# EAGLE design HighPowerLEDBabyBell (EAGLE 9.6.2)
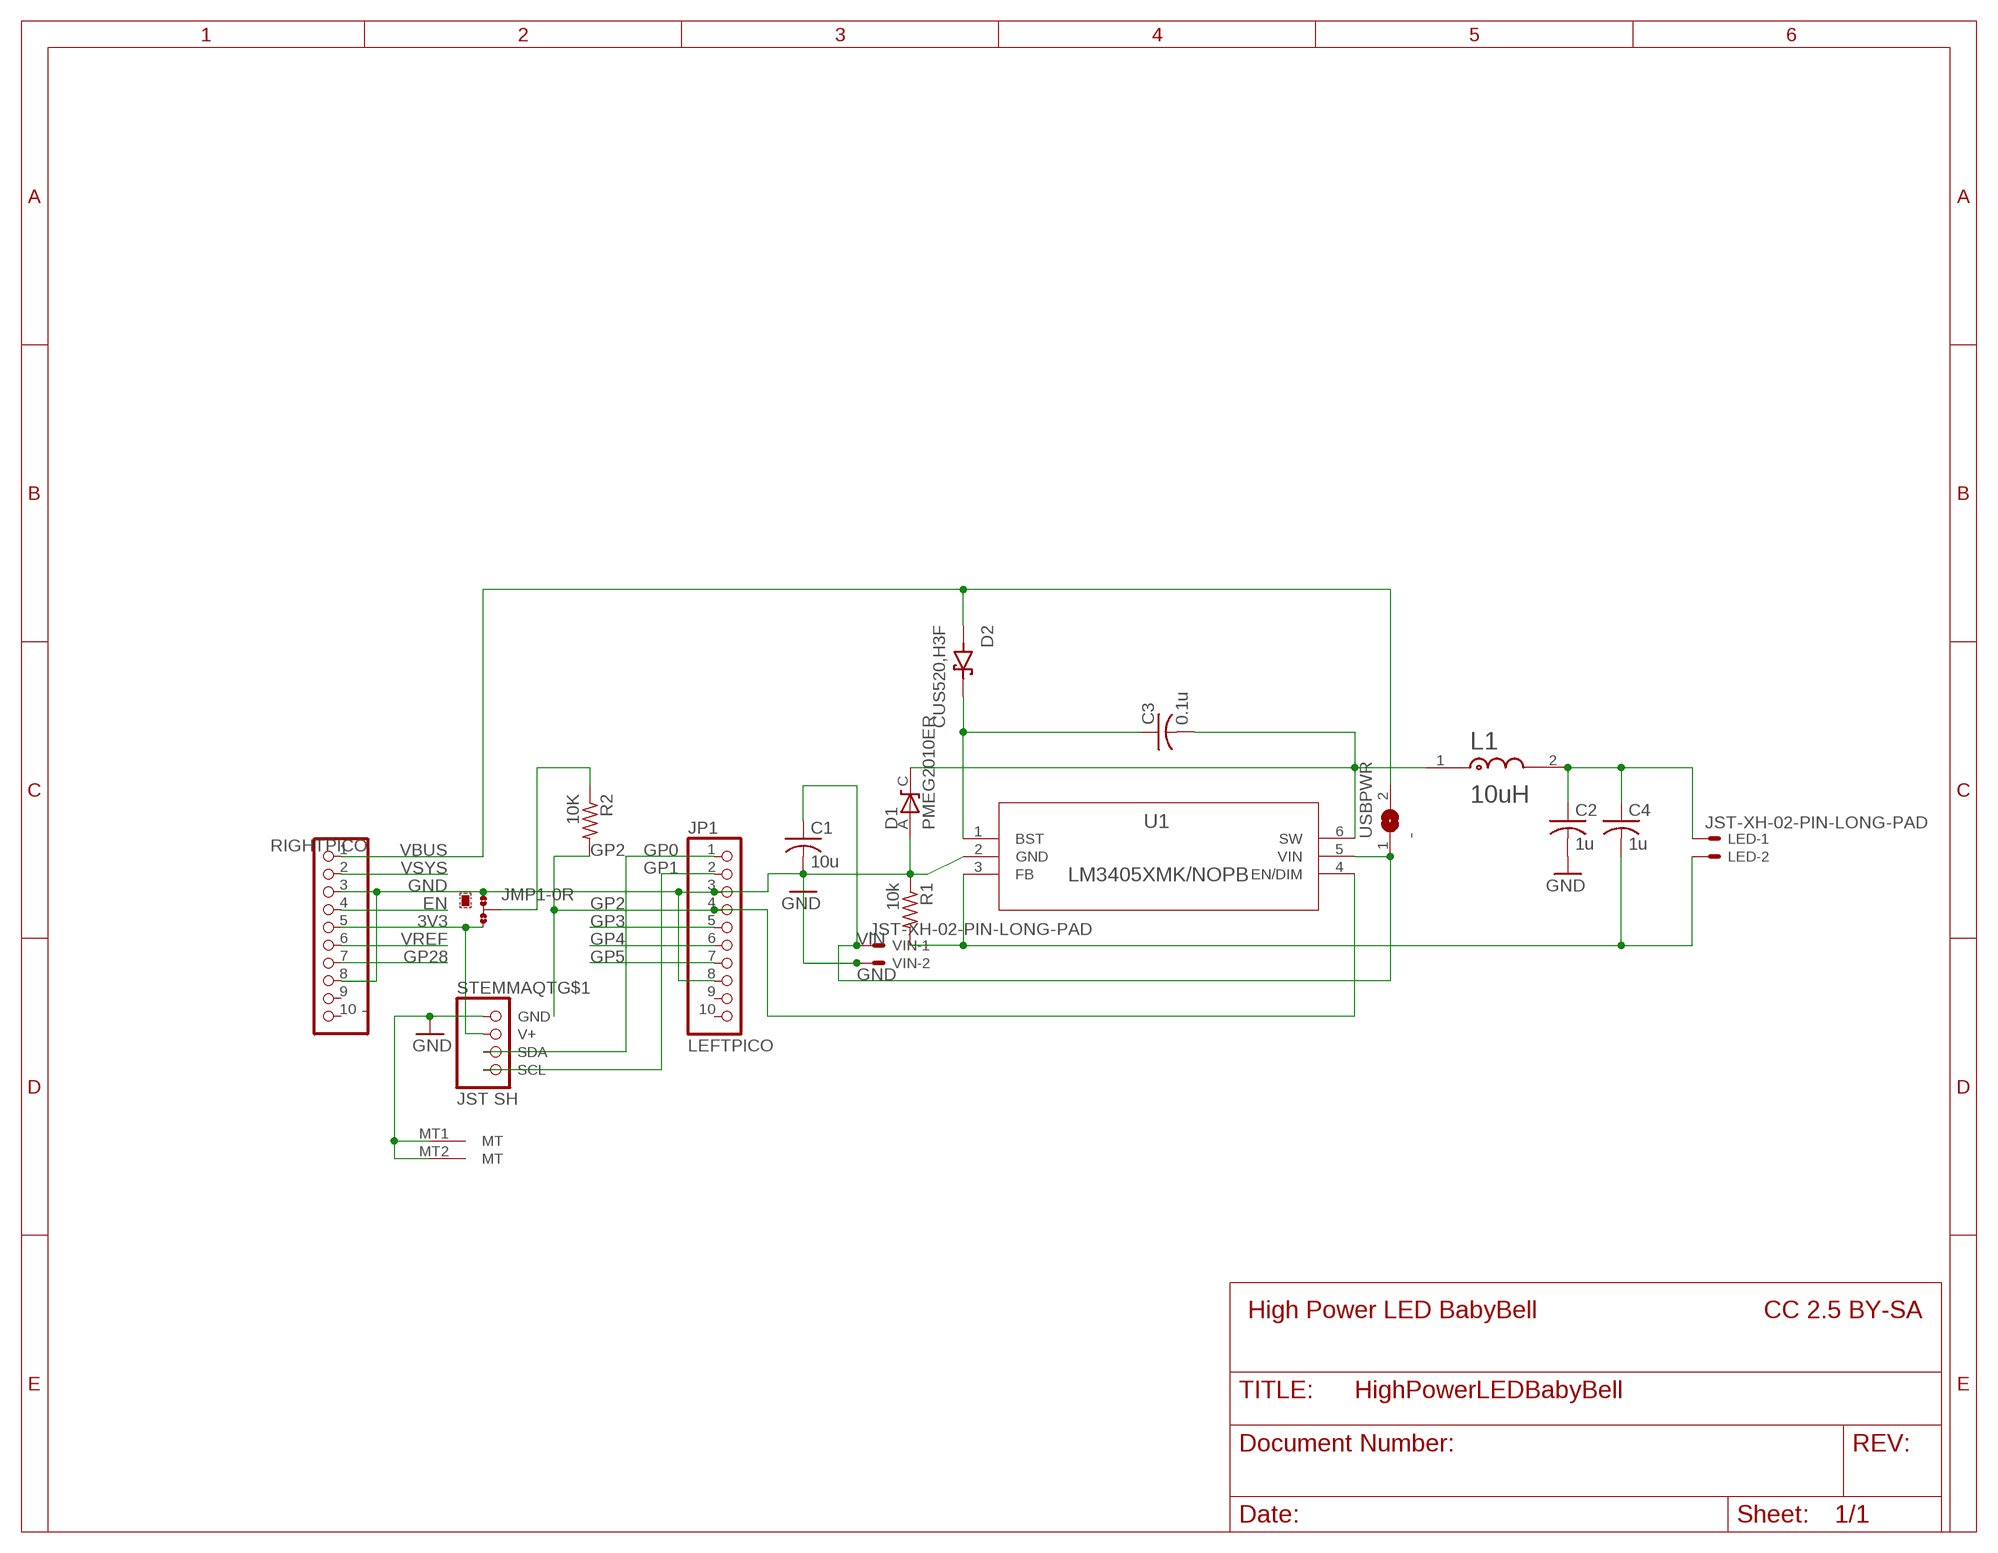
[diagram p0: schematic, sheet 1]

## Parts
C1  10u  C-USC1206  [C1206]
C2  1u  C-USC1206  [C1206]
C3  0.1u  C-USC1206  [C1206]
C4  1u  C-USC1206  [C1206]
D1  PMEG2010ER  [SODFL3517X110N]
D2  CUS520,H3F  [DIO_CUS520,H3F]
JMP1  0R-JUMPA  [A0R-JMP]
JP1  LEFTPICO  PINHD-1X10  [1X10]
L1  TDK_VLS5045EX-100MTDK_VLS5045EX-100M_0_0  [TDK_VLS5045EX-100M_0]
LED  JST-XH-02-PIN-LONG-PAD  [JST-XH-02-PACKAGE-LONG-PAD]
R1  10k  R-US_R1206  [R1206]
R2  10K  R-US_R1206  [R1206]
RIGHTPICO  -  PINHD-1X10  [1X10]
STEMMAQT  JST SH  STEMMA_I2C_QTRA  [JST_SH4_RA]
U1  LM3405XMK/NOPB  [MK06A]
USBPWR  -  SJ  [SJ]
VIN  JST-XH-02-PIN-LONG-PAD  [JST-XH-02-PACKAGE-LONG-PAD]

## Nets
3V3: JMP1.3 RIGHTPICO.5 STEMMAQT.2(V+)
BST: C3.1 D2.C U1.1(BST)
EN: RIGHTPICO.4
FB: C4.2 LED.2 R1.2 U1.3(FB)
GND [power]: C1.2 C2.2 D1.A JMP1.1 JP1.3 JP1.8 R1.1 RIGHTPICO.3 RIGHTPICO.8 STEMMAQT.1(GND) STEMMAQT.MT1(MT) STEMMAQT.MT2(MT) U1.2(GND) VIN.2
GP0: JP1.1 STEMMAQT.3(SDA)
GP1: JP1.2 STEMMAQT.4(SCL)
GP2: JP1.4 R2.2 U1.4(EN/DIM)
GP3: JP1.5
GP4: JP1.6
GP5: JP1.7
GP28: RIGHTPICO.7
LED+: C2.1 C4.1 L1.2 LED.1
PUL [power]: JMP1.2 R2.1
SW: C3.2 D1.C L1.1 U1.6(SW)
VBUS: D2.A RIGHTPICO.1 USBPWR.2
VIN [power]: C1.1 U1.5(VIN) USBPWR.1 VIN.1
VREF: RIGHTPICO.6
VSYS: RIGHTPICO.2
Unconnected: JP1.9 JP1.10 RIGHTPICO.9 RIGHTPICO.10

## Notes on the sheet
- High Power LED BabyBell | CC 2.5 BY-SA

## Library data of the parts
C1-C4 = rcl:C-US: CAPACITOR, American symbol; SPICEPREFIX: C
D1 = PMEG2010ER:PMEG2010ER: Diode Schottky 20V 1A 2-Pin SOD-123W T/R; DESCRIPTION: Diode Schottky 20 V 1A Surface Mount SOD-123W; MF: Nexperia USA; MP: PMEG2010ER; PACKAGE: SOD-123W Nexperia USA Inc.; PURCHASE-URL: https://pricing.snapeda.com/search/part/PMEG2010ER/?ref=eda
D2 = CUS520_H3F:CUS520,H3F: Diode Schottky 30V 200mA Surface Mount USC; DESCRIPTION: Diode Schottky 30 V 200mA Surface Mount USC; DIGI-KEY_PART_NUMBER: CUS520H3FTR-ND; MF: Toshiba Semiconductor; MP: CUS520,H3F; PACKAGE: SOD-323 Toshiba; PURCHASE-URL: https://pricing.snapeda.com/search/part/CUS520,H3F/?ref=eda
JMP1 = jump-0r-smd:0R-JUMP: SMD 0R 0805 Jumper
JP1 RIGHTPICO = pinhead_dan:PINHD-1X10: PIN HEADER
L1 = TDK - VLS5045EX-100M:TDK_VLS5045EX-100M: 10µH Shielded Wirewound Inductor 2.5A 79.3mOhm Max Nonstandard; AUTOMOTIVE: No; CENTROID_NOT_SPECIFIED: No; COMPOSITION: Wirewound; CORE_MATERIAL: Ferrite; DATASHEET: https://product.tdk.com/system/files/dam/doc/product/inductor/inductor/smd/catalog/inductor_commercial_power_vls5045ex_en.pdf; DEVICE_CLASS_L1: Passive Components; DEVICE_CLASS_L2: Inductors; DEVICE_CLASS_L3: Fixed Inductors; DIGIKEY_DESCRIPTION: FIXED IND 10UH 2.5A 79.3 MOHM; DIGIKEY_PART_NUMBER: 445-174843-1-ND; FOOTPRINT_VARIANT_NAME_0: Recommended_Land_Pattern; HEIGHT: 4.5mm; INDUCTANCE: 10uH; LEAD_FREE: Yes; MF: TDK; MFG_PACKAGE_IDENT: 0; MFG_PACKAGE_IDENT_DATE: 0; MFG_PACKAGE_IDENT_REV: 0; MOUSER_PART_NUMBER: 810-VLS5045EX-100M; MPN: VLS5045EX-100M; PACKAGE: SMD_IND_5MM0_5MM0; PREFIX: L; RMS_CURRENT: 2.5A; ROHS: Yes; SATURATION_CURRENT: 3.1A; SERIES_RESISTANCE: 79.3mΩ; SHIELDING: true; TEMPERATURE_RANGE_HIGH: +105°C; TEMPERATURE_RANGE_LOW: -40°C; TEST_FREQUENCY: 100kHz; TOLERANCE: 20%; VERIFICATION_VERSION: 0.0.0.3
LED VIN = Rembrandt Electronics - JST XH Connectors v1-0:JST-XH-02-PIN: JST XH Connector 2 Pin Wire to board connector. Pitch: 2,54 mm, (0.100") Number of pins: 2 Created by Rembrandt Electronics www.rembrandtelectronics.com
R1 R2 = rcl:R-US_: RESISTOR, American symbol; SPICEPREFIX: R
STEMMAQT = microbuilder:STEMMA_I2C
U1 = LM3405:LM3405XMK/NOPB; COPYRIGHT: Copyright (C) 2023 Ultra Librarian. All rights reserved.; MANUFACTURER_PART_NUMBER: LM3405XMK/NOPB; MFR_NAME: Texas Instruments
USBPWR = jumper:SJ: SMD solder JUMPER

## Net classes
1 power: width 0.305 mm
2 thickpower: width 0.406 mm

## Board
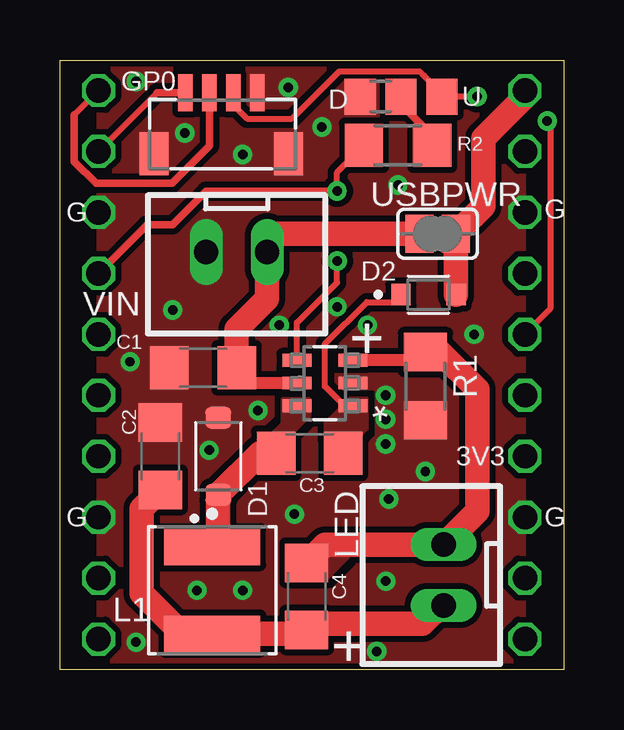
[diagram p1: board, top side]
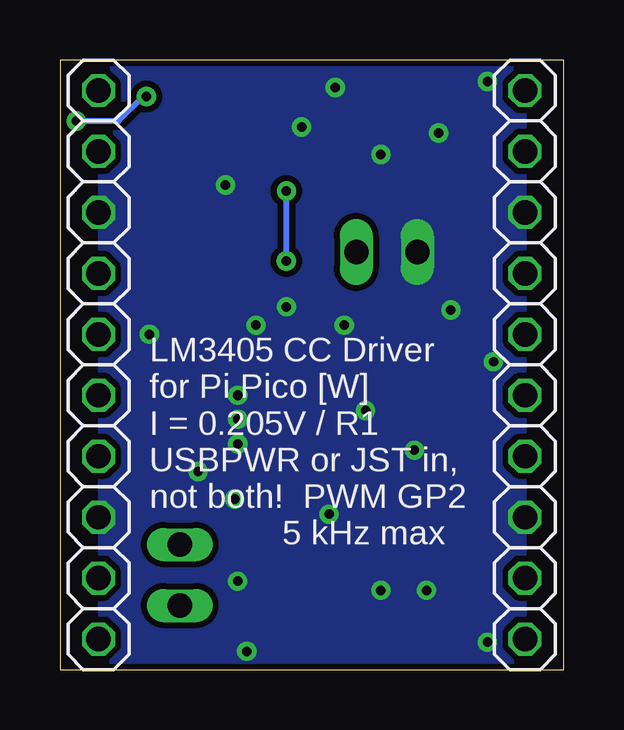
[diagram p2: board, bottom side, seen from below]

Size 21 x 25.4 mm. Coordinates in mm from the lower left corner, seen from the top.
Outline: 21,25.4 21,0 0,0 0,25.4 21,25.4
Copper layers (1*16): Top 0.035mm / dielectric 1.5mm / Bottom 0.035mm
Design rules "adafruit 7-7": minimum track width 7mil, minimum drill 15.5mil, track to track 7mil, track to pad 7mil, pad to pad 7mil, via to via 7mil, smd to smd 7mil, copper to edge 10mil, drill to drill 8mil, minimum pad ring 7mil, minimum via ring 8mil, stop-mask expansion 2mil, vias tented up to drill 20mil, thermal gap 10mil

### Footprints (pad centres in the part's own frame; a part is rotated, then mirrored left to right if it is on the bottom)
C1206 = smd 1.6 x 1.8: 1 -1.4,0; 2 1.4,0
SODFL3517X110N = smd 0.91 x 1.07: A 1.605,0; C -1.605,0
DIO_CUS520,H3F = smd 0.8 x 0.9: A 1.15,0; C -1.15,0
A0R-JMP = smd 1.5 x 1.3: 1 0,1.7; 2 0,0; 3 0,-1.7
1X10 = drill 1.016 octagon: 1 -11.43,0; 2 -8.89,0; 3 -6.35,0; 4 -3.81,0; 5 -1.27,0; 6 1.27,0; 7 3.81,0; 8 6.35,0; 9 8.89,0; 10 11.43,0
TDK_VLS5045EX-100M_0 = smd 1.5 x 4: 1 -1.8,0; 2 1.8,0
JST-XH-02-PACKAGE-LONG-PAD = drill 1.016 long: 1 -1.27,0; 2 1.27,0
R1206 = smd 1.6 x 1.803: 1 -1.422,0; 2 1.422,0
JST_SH4_RA = smd 0.6 x 1.55: 1 1.5,1.686; 2 0.5,1.686; 3 -0.5,1.686; 4 -1.5,1.686 | smd 1.2 x 1.8: MT1 -2.8,-0.862; MT2 2.8,-0.862
MK06A = smd 1.219 x 0.533: 1 -1.168,0.95; 2 -1.168,0; 3 -1.168,-0.95; 4 1.168,-0.95; 5 1.168,0; 6 1.168,0.95
SJ = smd 1.168 x 1.6: 1 -0.762,0; 2 0.762,0

### Placement (x,y rotation side)
C1  5.97,12.57 180 top
C2  4.19,8.89 90 top
C3  10.41,9.02 180 top
C4  10.29,3.05 90 top
D1  6.6,8.89 90 top
D2  15.37,15.62 0 top
JMP1  14.22,23.88 90 top
JP1  1.61,12.7 270 bottom
L1  6.35,3.3 270 top
LED  16,3.94 90 top
R1  15.24,11.81 90 top
R2  14.1,21.84 180 top
RIGHTPICO  19.39,12.7 270 bottom
STEMMAQT  6.73,22.35 0 top
U1  11.05,11.94 180 top
USBPWR  15.75,18.16 0 top
VIN  7.37,17.4 180 top

### Tracks (layer width: path | path; a pad name or v marks a point on that pad's centre or on a via)
3V3  (via drill 0.4)
  Top 0.254: v17.4,23.88 JMP1.3 15.92,24 15.18,24.75 15,24.93 11.65,24.93 9.67,22.96 7.8,22.96 7.25,23.52 7.25,24.02 STEMMAQT.2 | RIGHTPICO.5 20.45,15.03 20.45,22.73 v20.32,22.86
  Bottom 0.254: v20.32,22.86 18.54,22.86 17.53,23.88 v17.4,23.88
BST
  Top 0.254: D2.C 13.91,15.32 12.79,15.32 11.05,13.57 11.05,11.8 11.74,11.11 12.09,11.11 U1.1
  pour Top (isolate 0.254, no thermals): 12.83,11.3 12.06,11.3 11.05,10.29 11.05,9.78 12.57,9.78 12.83,10.03
FB
  Top 0.508: U1.3 15.28,12.89 15.28,13.2 R1.2 15.85,13.23
  Top 1.016: C4.2 11.05,5.21 LED.2 17.4,6.6 17.4,11.68 15.85,13.23
  pour Top (isolate 0.254, no thermals): 11.05,3.68 12.06,4.7 11.05,4.7
GND  (via drill 0.39, 0.4)
  other vias: 13.59,11.43 13.59,10.43 13.59,9.4 2.92,12.83 14.1,20.19 4.7,14.99 6.22,9.14 5.71,3.3 7.62,3.3 9.78,6.48 13.59,3.68 15.24,8.26 13.72,7.11 17.27,13.97 8.26,10.79 12.83,14.35 3.17,24.51 5.21,22.35 9.53,24.26 13.21,0.76 3.17,1.14 9.14,14.35 7.62,21.46 10.92,22.61 11.56,15.11
  pour Top (isolate 0.254, rank 2, no thermals): 1.65,0 1.65,25.4 19.3,25.4 19.3,0
  pour Bottom (isolate 0.254, no thermals): 1.65,0 1.65,25.4 19.3,25.4 19.3,0
GP0
  Top 0.254: 0.59,23.11 JP1.1
  Top 0.305: STEMMAQT.3 6.23,21.82 4.67,20.26 1.5,20.26 0.59,21.17 0.59,23.11
GP1
  Top 0.254: JP1.2 4.06,24.04
  Top 0.305: 4.06,24.04 STEMMAQT.4
GP2  (via drill 0.39, 0.4)
  Top 0.254: U1.4 9.88,14.45 11.56,16.13 v11.56,17.02 | v11.56,19.94 11.56,20.73 R2.2
  Top 0.305: JP1.4 3.64,18.54 4.7,18.54 6.1,19.94 v11.56,19.94
  Bottom 0.254: v11.56,17.02 v11.56,19.94
LED+
  Top 1.016: C2.1 3.41,6.71 3.41,3.18 5.09,1.5 L1.2 10.14,1.5 C4.1 10.54,1.91 15.11,1.91 15.88,2.67 LED.1
PUL
  Top 0.305: R2.1 15.52,22.27 14.22,23.56 JMP1.2
SW
  Top 1.016: L1.1 6.6,5.36 D1.C 8.34,9.02 C3.2
  pour Top (isolate 0.254, no thermals): 8.76,9.78 9.27,10.29 9.27,11.3 10.41,11.3 10.41,10.54 9.65,9.78
VBUS
  Top 1.016: RIGHTPICO.1 19.39,23.88 17.65,22.14 17.65,19.3 USBPWR.2 D2.A
VIN
  Top 0.508: U1.5 7.91,11.94 7.37,12.48 C1.1
  Top 1.016: USBPWR.1 8.64,18.16 VIN.1 8.64,15.44 7.37,14.18 C1.1

### Text on the board
tPlace: GP0 | D | U | G | G | + | 3V3 | G | G | +
bPlace: LM3405 CC Driver / for Pi Pico [W] / I = 0.205V / R1 / USBPWR or JST in, / not both! PWM GP2 / 5 kHz max